# EAGLE design RPi 433MHz Interface Board (EAGLE 7.3.0)
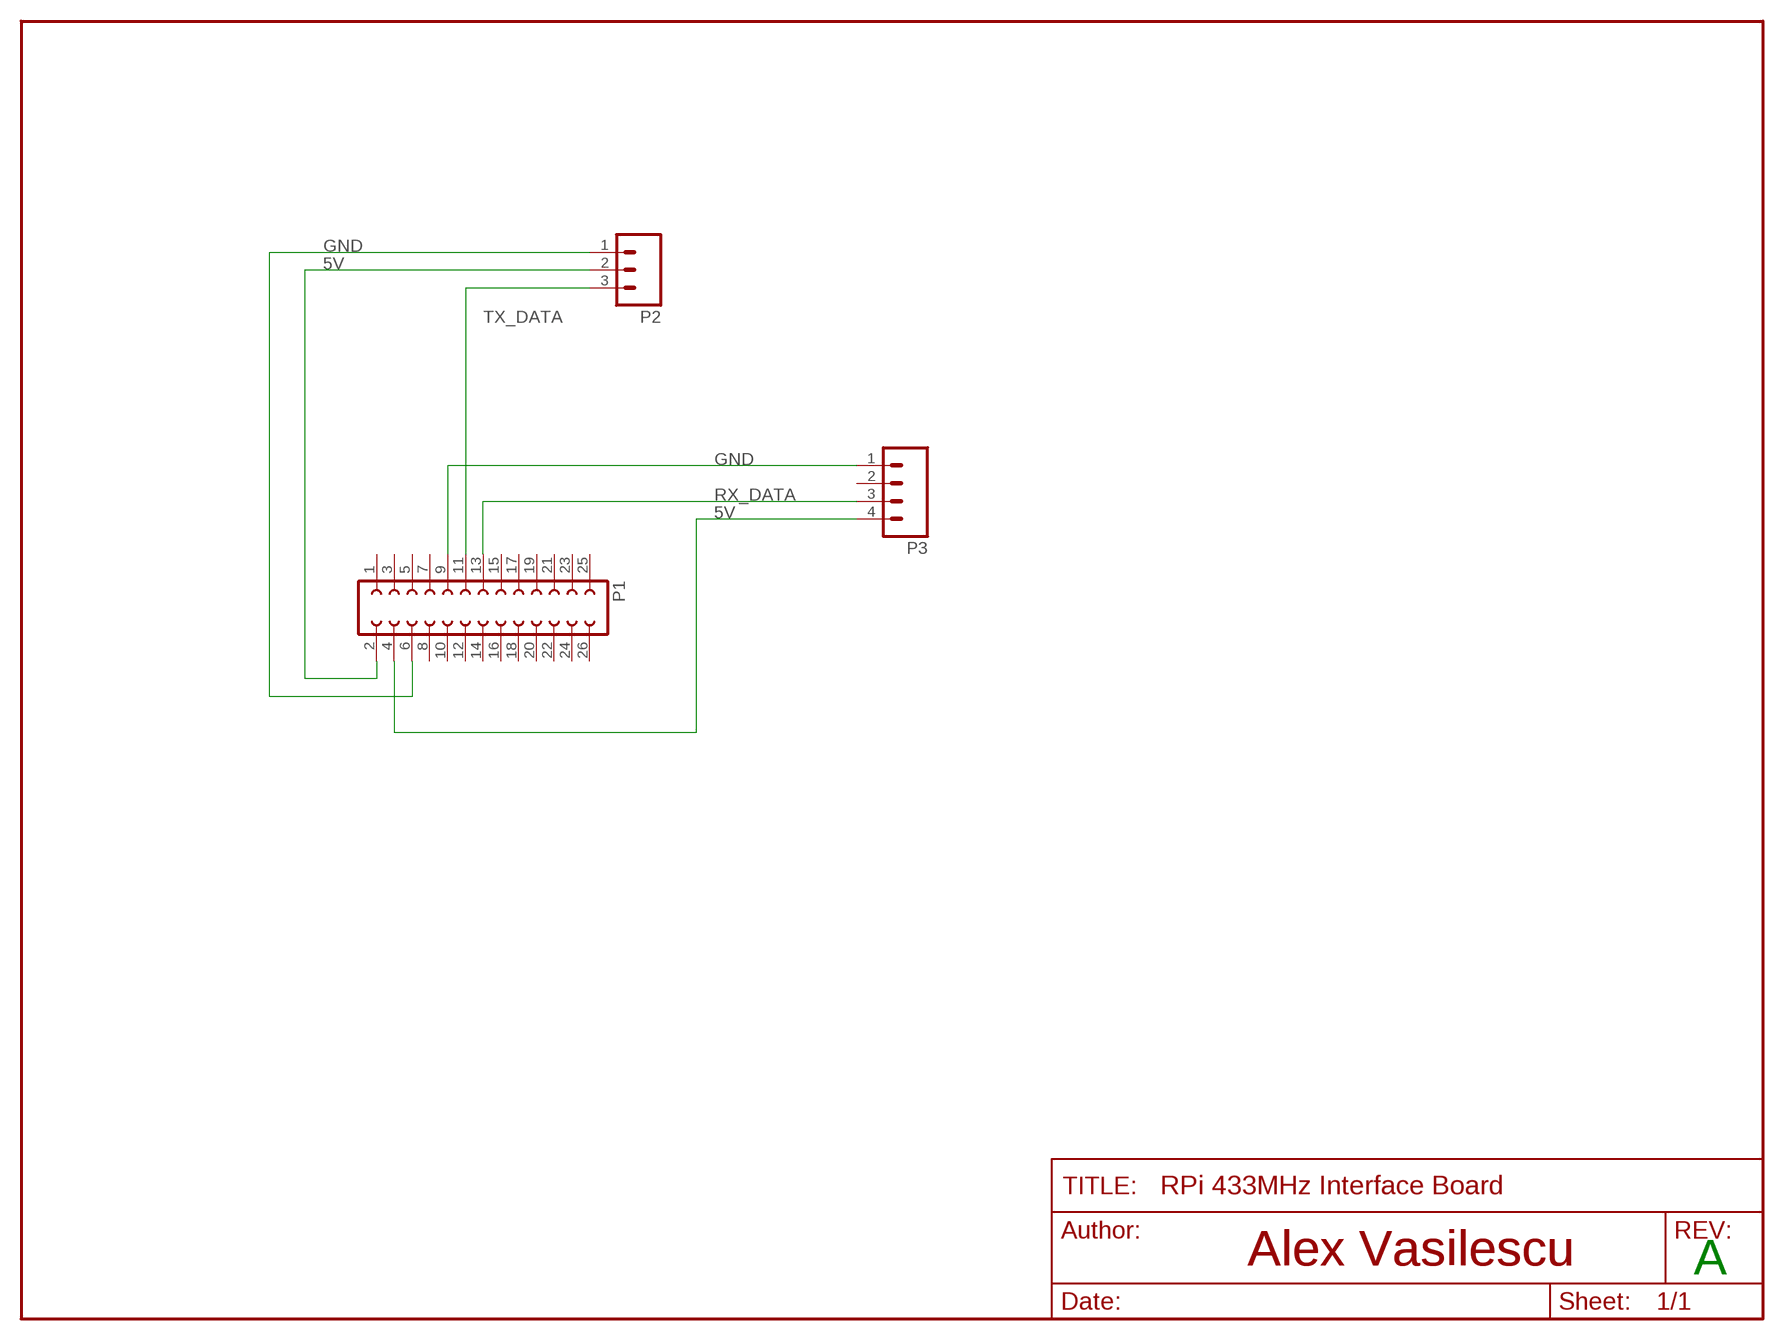
[diagram p0: schematic, sheet 1]

## Parts
P1  FE13-2  [FE13-2]
P2  M03POLAR  [MOLEX-1X3]
P3  M04POLAR  [MOLEX-1X4]
U$1  AV-LOGO  [AV-LOGO]

## Nets
5V: P1.2 P1.4 P2.2 P3.4
GND: P1.6 P1.9 P2.1 P3.1
RX_DATA: P1.13 P3.3
TX_DATA: P1.11 P2.3
Unconnected: P1.1 P1.3 P1.5 P1.7 P1.8 P1.10 P1.12 P1.14 P1.15 P1.16 P1.17 P1.18 P1.19 P1.20 P1.21 P1.22 P1.23 P1.24 P1.25 P1.26 P3.2

## Notes on the sheet
- A

## Library data of the parts
P1 = con-lsta:FE13-2: FEMALE HEADER; OC_FARNELL: unknown; OC_NEWARK: unknown
P2 = SparkFun-Connectors:M03: Header 3 Standard 3-pin 0.1" header. Use with straight break away headers (SKU : PRT-00116), right angle break away headers (PRT-00553), swiss pins (PRT-00743), machine pins (PRT-00117), and female headers (PRT-00115). Molex polarized connector foot print use with SKU : PRT-08232 with associated crimp pins and housings.
P3 = SparkFun-Connectors:M04: Header 4 Standard 4-pin 0.1" header. Use with straight break away headers (SKU : PRT-00116), right angle break away headers (PRT-00553), swiss pins (PRT-00743), machine pins (PRT-00117), and female headers (PRT-00115). Molex polarized connector foot print use with SKU : PRT-08231 with associated crimp pins and housings. 1MM SMD Version SKU: PRT-10208
U$1 = AlexLibrary:AV-LOGO

## Net classes
0 default: clearance 0.205 mm

## Board
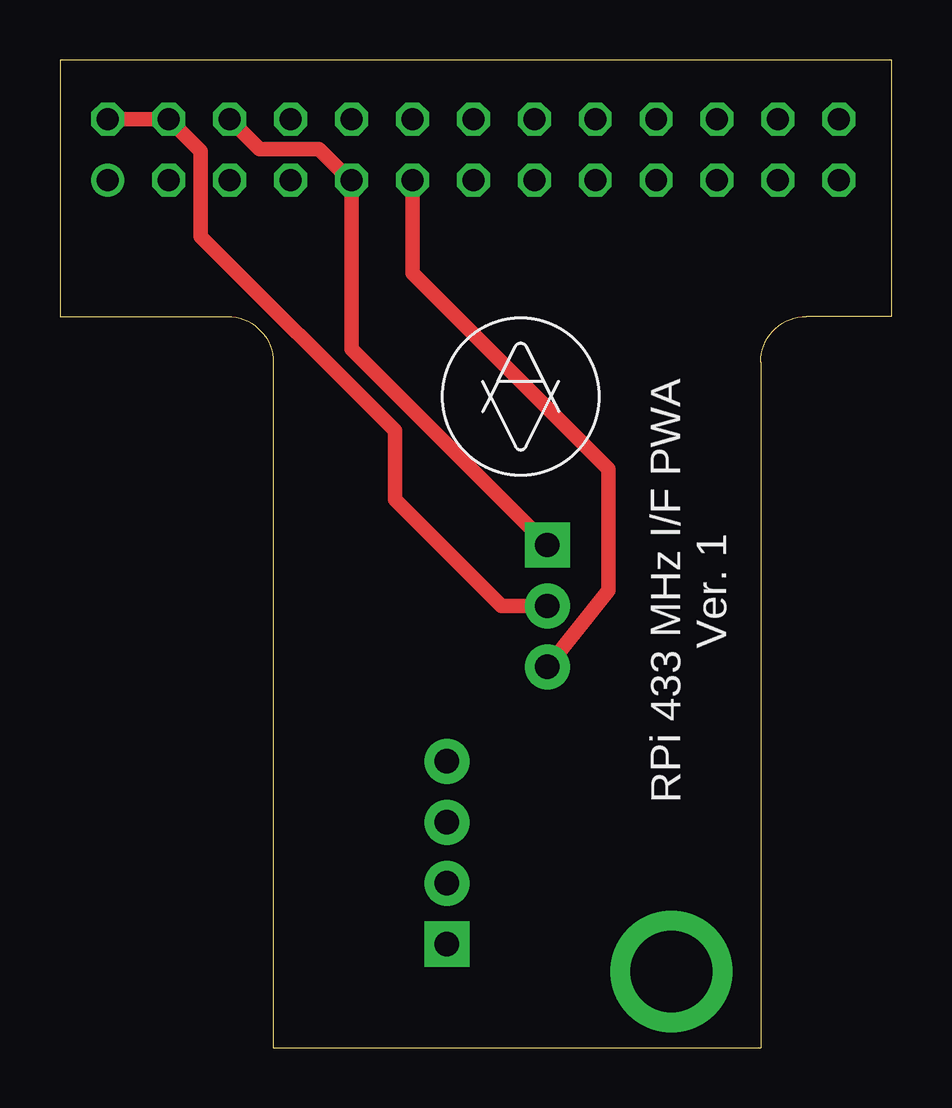
[diagram p1: board, top side]
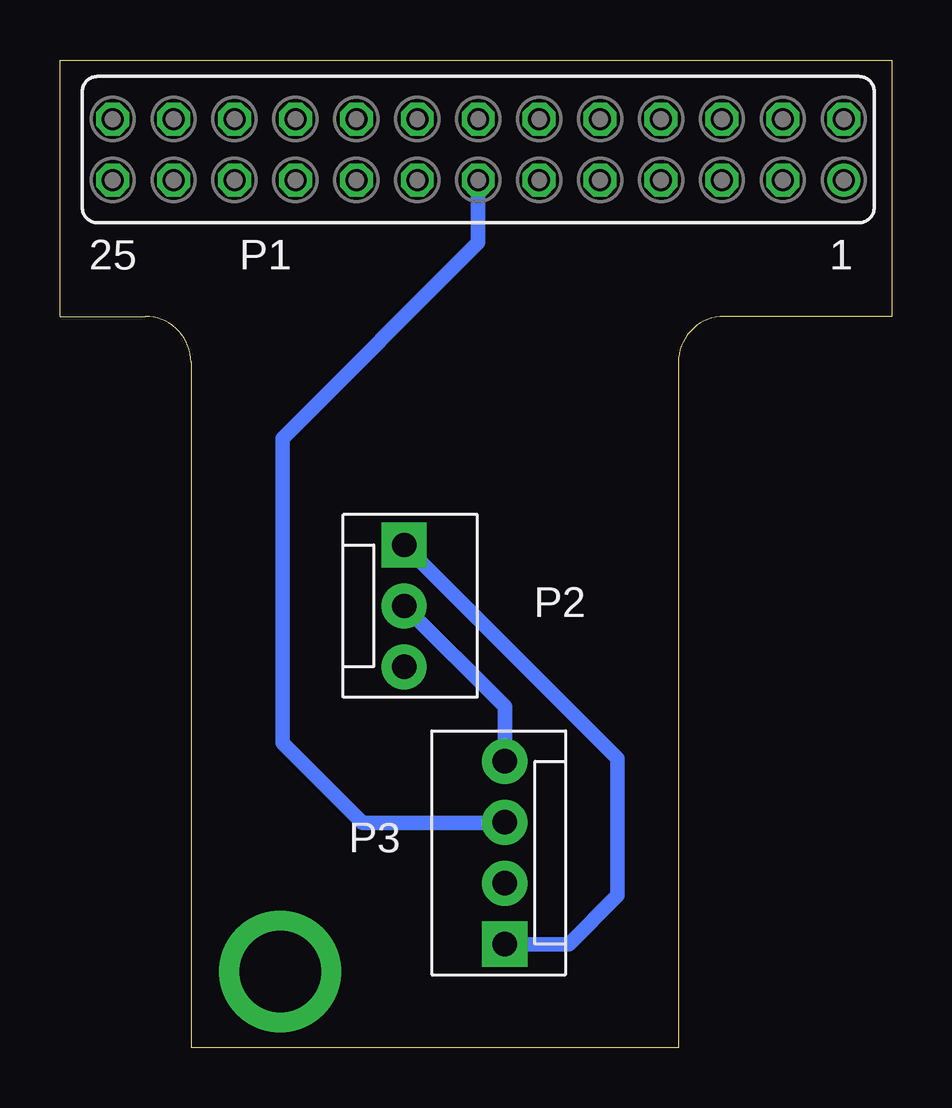
[diagram p2: board, bottom side, seen from below]

Size 34.67 x 41.17 mm. Coordinates in mm from the lower left corner, seen from the top.
Outline: 8.89,0 29.21,0 29.21,28.57 arc-90 31.11,30.48 34.67,30.48 34.67,41.17 0,41.17 0,30.48 6.99,30.48 arc-90 8.89,28.57 8.89,0
Copper layers (1*16): Top 0.0356mm / dielectric 1.5011mm / Bottom 0.0356mm
Design rules "LaenPCBOrder": minimum track width 6mil, minimum drill 13mil, track to track 6mil, track to pad 6mil, pad to pad 6mil, via to via 6mil, smd to smd 6mil, copper to edge 15mil, drill to drill 6mil, minimum pad ring 7mil, minimum via ring 7mil, stop-mask expansion 3mil, vias tented up to drill 0mil, thermal gap 10mil

### Footprints (pad centres in the part's own frame; a part is rotated, then mirrored left to right if it is on the bottom)
FE13-2 = drill 0.914: 1 -15.24,1.27 | drill 0.914 octagon: 2 -15.24,-1.27; 3 -12.7,1.27; 4 -12.7,-1.27; 5 -10.16,1.27; 6 -10.16,-1.27; 7 -7.62,1.27; 8 -7.62,-1.27; 9 -5.08,1.27; 10 -5.08,-1.27; 11 -2.54,1.27; 12 -2.54,-1.27; 13 0,1.27; 14 0,-1.27; 15 2.54,1.27; 16 2.54,-1.27; 17 5.08,1.27; 18 5.08,-1.27; 19 7.62,1.27; 20 7.62,-1.27; 21 10.16,1.27; 22 10.16,-1.27; 23 12.7,1.27; 24 12.7,-1.27; 25 15.24,1.27; 26 15.24,-1.27
MOLEX-1X3 = drill 1.016 pad 1.88 square: 1 0,0 | drill 1.016 pad 1.88: 2 2.54,0; 3 5.08,0
MOLEX-1X4 = drill 1.016 pad 1.88 square: 1 0,0 | drill 1.016 pad 1.88: 2 2.54,0; 3 5.08,0; 4 7.62,0

### Placement (x,y rotation side)
P1  17.23,37.44 180 bottom
P2  20.32,20.95 270 bottom
P3  16.13,4.32 90 bottom
U$1  19.21,27.15 0 top

### Tracks (layer width: path | path; a pad name or v marks a point on that pad's centre or on a via)
5V
  Top 0.61: P1.2 P1.4 5.87,37.37 5.87,33.81 13.97,25.72 13.97,22.86 18.41,18.41 P2.2
  Bottom 0.61: P3.4 16.13,14.22 P2.2
GND
  Top 0.61: P1.6 8.32,37.47 10.79,37.47 12.09,36.17 P1.9 12.15,29.12 P2.1
  Bottom 0.61: P3.1 13.46,4.32 11.43,6.35 11.43,12.06 P2.1
N$1  (via drill 3.4 pad 5.08)
  other vias: 25.49,3.17
RX_DATA
  Bottom 0.61: P1.13 17.23,33.57 25.4,25.4 25.4,12.7 22.07,9.37 16.16,9.37 P3.3
TX_DATA
  Top 0.61: P1.11 14.69,32.3 22.86,24.13 22.86,19.05 P2.3

### Text on the board
tPlace: RPi 433 MHz I/F PWA / Ver. 1